# Altium schematic sheet mod_hw_tb6612.SchDoc
size A4; SheetNumber: 1; SheetTotal: 1
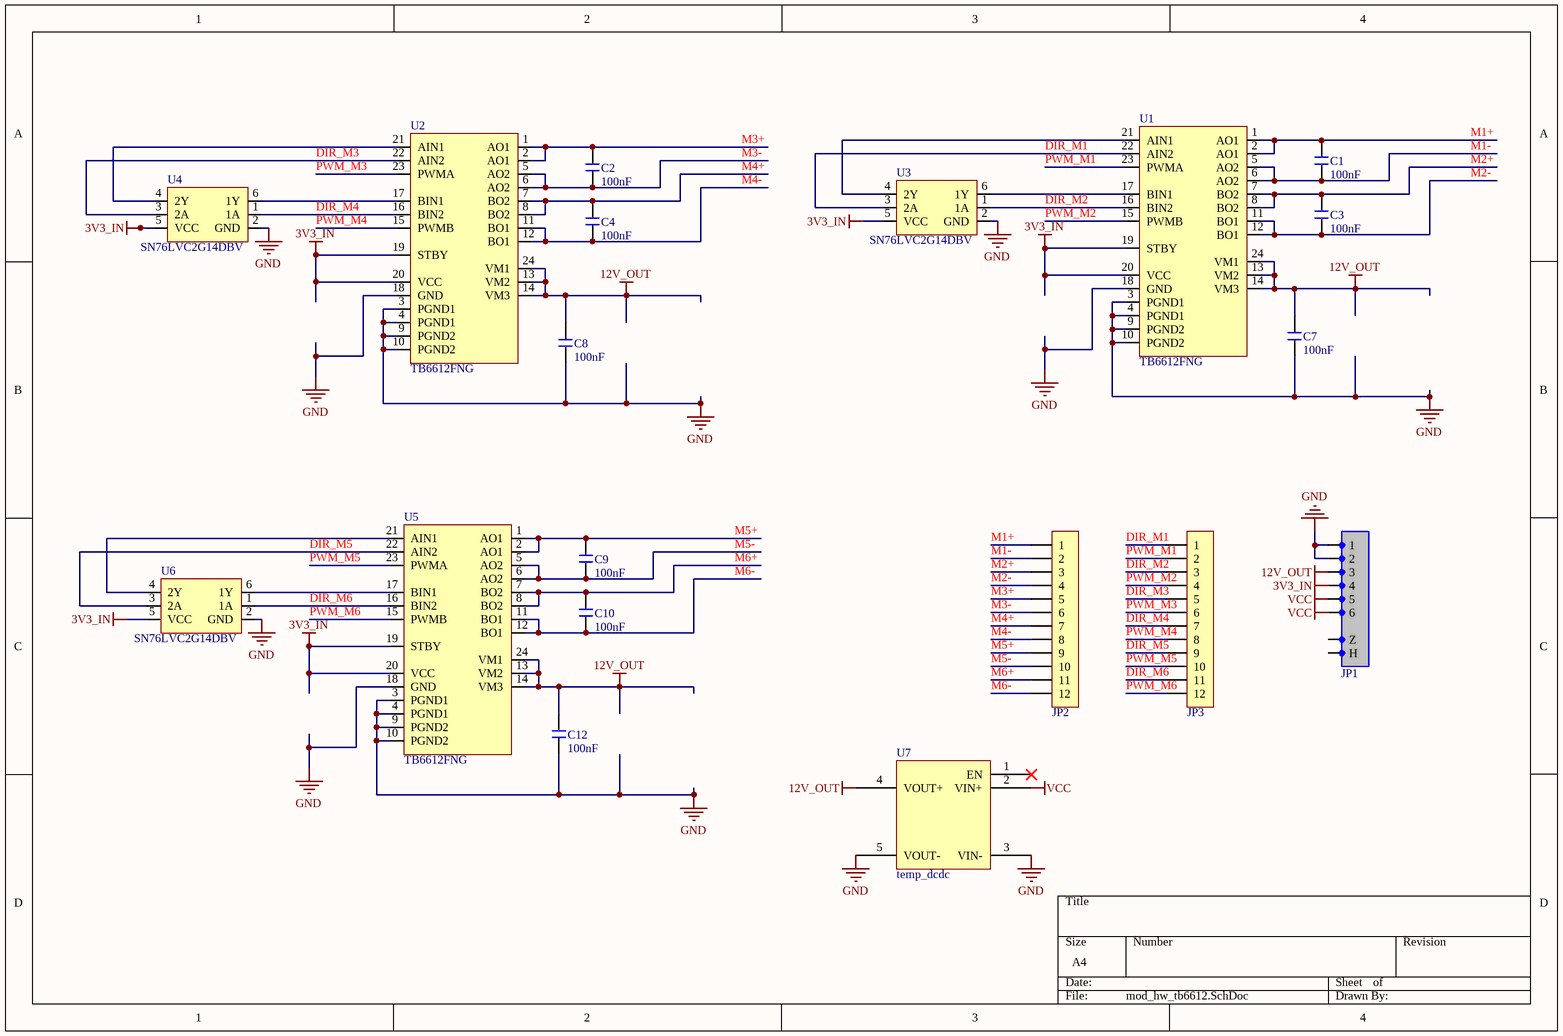
[diagram p0: mod_hw_tb6612.SchDoc]

## Parts
C1  100nF  [C 0603_L]
C2  100nF  [C 0603_L]
C3  100nF  [C 0603_L]
C4  100nF  [C 0603_L]
C7  100nF  [C 1206_L]
C8  100nF  [C 1206_L]
C9  100nF  [C 0603_L]
C10  100nF  [C 0603_L]
C12  100nF  [C 1206_L]
JP1  HDR-1X6  [HDR2.54-M-LI-6P]  (value not drawn)
JP2  HDR-1X12  [HDR2.54-M-LI-12P]  (value not drawn)
JP3  HDR-1X12  [HDR2.54-M-LI-12P]  (value not drawn)
U1  TB6612FNG  [SSOP24_N]
U2  TB6612FNG  [SSOP24_N]
U3  SN76LVC2G14DBV  [SOT23-6N]
U4  SN76LVC2G14DBV  [SOT23-6N]
U5  TB6612FNG  [SSOP24_N]
U6  SN76LVC2G14DBV  [SOT23-6N]
U7  temp_dcdc  [TEMP_12V]

## Nets
3V3_IN: JP1.4 U1.19(STBY) U1.20(VCC) U2.19(STBY) U2.20(VCC) U3.5(VCC) U4.5(VCC) U5.19(STBY) U5.20(VCC) U6.5(VCC)
12V_OUT: C7.2 C8.2 C12.2 JP1.3 U1.13(VM2) U1.14(VM3) U1.24(VM1) U2.13(VM2) U2.14(VM3) U2.24(VM1) U5.13(VM2) U5.14(VM3) U5.24(VM1) U7.4(VOUT+)
GND: C7.1 C8.1 C12.1 JP1.1 JP1.2 U1.3(PGND1) U1.4(PGND1) U1.9(PGND2) U1.10(PGND2) U1.18(GND) U2.3(PGND1) U2.4(PGND1) U2.9(PGND2) U2.10(PGND2) U2.18(GND) U3.2(GND) U4.2(GND) U5.3(PGND1) U5.4(PGND1) U5.9(PGND2) U5.10(PGND2) U5.18(GND) U6.2(GND) U7.3(VIN-) U7.5(VOUT-)
VCC: JP1.5 JP1.6 U7.2(VIN+)
DIR_M1: JP3.1 U1.22(AIN2) U3.3(2A)
DIR_M2: JP3.3 U1.16(BIN2) U3.1(1A)
DIR_M3: JP3.5 U2.22(AIN2) U4.3(2A)
DIR_M4: JP3.7 U2.16(BIN2) U4.1(1A)
DIR_M5: JP3.9 U5.22(AIN2) U6.3(2A)
DIR_M6: JP3.11 U5.16(BIN2) U6.1(1A)
M1+: C1.2 JP2.1 U1.1(AO1) U1.2(AO1)
M1-: C1.1 JP2.2 U1.5(AO2) U1.6(AO2)
M2+: C3.2 JP2.3 U1.7(BO2) U1.8(BO2)
M2-: C3.1 JP2.4 U1.11(BO1) U1.12(BO1)
M3+: C2.2 JP2.5 U2.1(AO1) U2.2(AO1)
M3-: C2.1 JP2.6 U2.5(AO2) U2.6(AO2)
M4+: C4.2 JP2.7 U2.7(BO2) U2.8(BO2)
M4-: C4.1 JP2.8 U2.11(BO1) U2.12(BO1)
M5+: C9.2 JP2.9 U5.1(AO1) U5.2(AO1)
M5-: C9.1 JP2.10 U5.5(AO2) U5.6(AO2)
M6+: C10.2 JP2.11 U5.7(BO2) U5.8(BO2)
M6-: C10.1 JP2.12 U5.11(BO1) U5.12(BO1)
PWM_M1: JP3.2 U1.23(PWMA)
PWM_M2: JP3.4 U1.15(PWMB)
PWM_M3: JP3.6 U2.23(PWMA)
PWM_M4: JP3.8 U2.15(PWMB)
PWM_M5: JP3.10 U5.23(PWMA)
PWM_M6: JP3.12 U5.15(PWMB)
NetU1_17: U1.17(BIN1) U3.6(1Y)
NetU1_21: U1.21(AIN1) U3.4(2Y)
NetU2_17: U2.17(BIN1) U4.6(1Y)
NetU2_21: U2.21(AIN1) U4.4(2Y)
NetU5_17: U5.17(BIN1) U6.6(1Y)
NetU5_21: U5.21(AIN1) U6.4(2Y)

Not connected (* = marked no-connect by the designer): JP1 0(Z) 100(H); U7 1(EN)*

## Library data of the parts
C1-C4 C7-C10 C12 = C: 无极性贴片电容; 版权归属: 源创客; BOM名称: 无极性贴片电容; 学习资源: www.ooocke.com
JP1 = Header 6: 6P接插件; 版权归属: 源创客; BOM名称: 6P接插件; 学习资源: www.ooocke.com
JP2 JP3 = Header 12: 12P接插件; 版权归属: 源创客; BOM名称: 12P接插件; 学习资源: www.ooocke.com
U1 U2 U5 = Component_1
U7 = temp_dcdc: 升降压模块